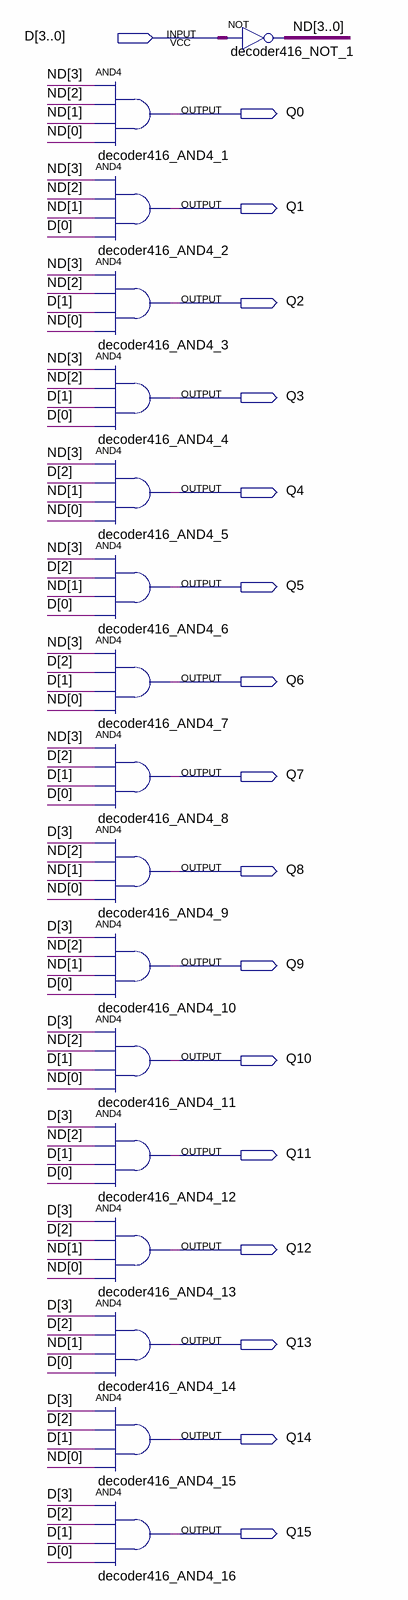
[diagram p0: schematic sheet]
// Quartus schematic decoder416.bdf as structural Verilog: 17 symbols, 17 pins
module decoder416 (
  input  [3:0] D,
  output Q0,
  output Q1,
  output Q2,
  output Q3,
  output Q4,
  output Q5,
  output Q6,
  output Q7,
  output Q8,
  output Q9,
  output Q10,
  output Q11,
  output Q12,
  output Q13,
  output Q14,
  output Q15
);

  wire [3:0] ND;

  and decoder416_AND4_1 (Q0, ND[3], ND[2], ND[1], ND[0]);
  and decoder416_AND4_2 (Q1, ND[3], ND[2], ND[1], D[0]);
  and decoder416_AND4_3 (Q2, ND[3], ND[2], D[1], ND[0]);
  and decoder416_AND4_4 (Q3, ND[3], ND[2], D[1], D[0]);
  and decoder416_AND4_5 (Q4, ND[3], D[2], ND[1], ND[0]);
  and decoder416_AND4_6 (Q5, ND[3], D[2], ND[1], D[0]);
  and decoder416_AND4_7 (Q6, ND[3], D[2], D[1], ND[0]);
  and decoder416_AND4_8 (Q7, ND[3], D[2], D[1], D[0]);
  and decoder416_AND4_9 (Q8, D[3], ND[2], ND[1], ND[0]);
  and decoder416_AND4_10 (Q9, D[3], ND[2], ND[1], D[0]);
  and decoder416_AND4_11 (Q10, D[3], ND[2], D[1], ND[0]);
  and decoder416_AND4_12 (Q11, D[3], ND[2], D[1], D[0]);
  and decoder416_AND4_13 (Q12, D[3], D[2], ND[1], ND[0]);
  and decoder416_AND4_14 (Q13, D[3], D[2], ND[1], D[0]);
  and decoder416_AND4_15 (Q14, D[3], D[2], D[1], ND[0]);
  and decoder416_AND4_16 (Q15, D[3], D[2], D[1], D[0]);
  assign ND = ~D;  // NOT decoder416_NOT_1, 4 bits wide
endmodule
